# Altium project Fastino-DIOT.PrjPCB (part 1 of 8)
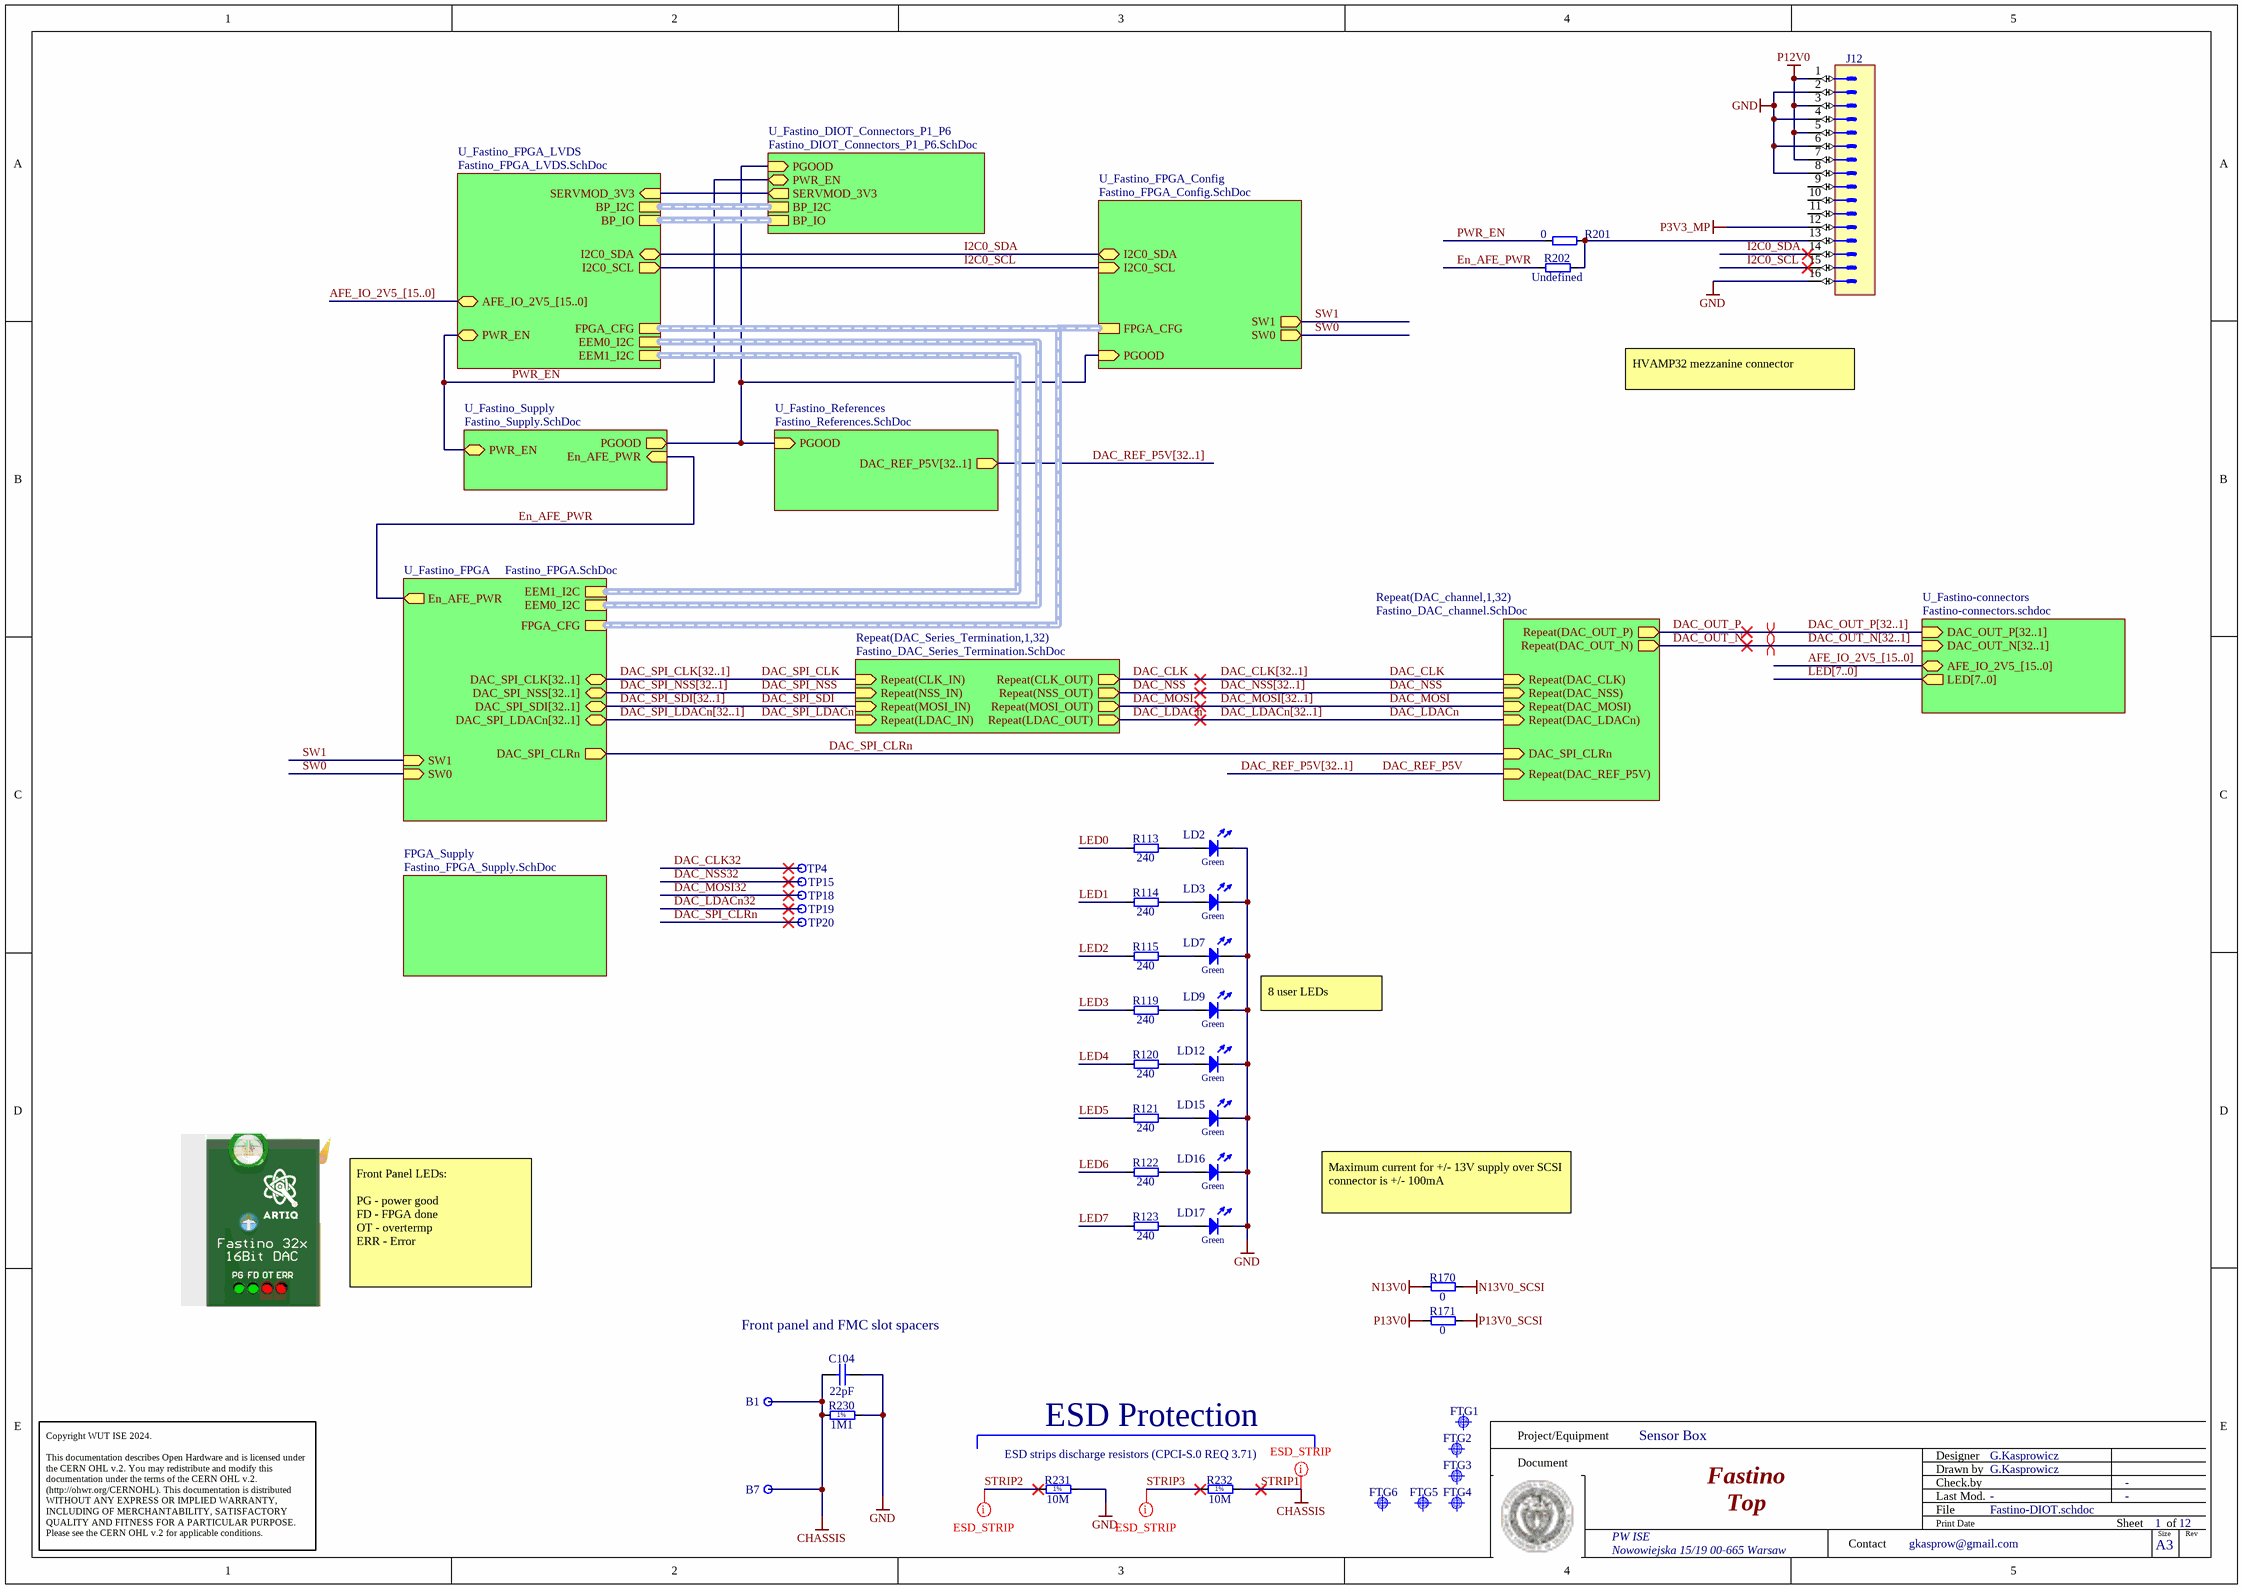
[diagram p0: Fastino-DIOT.schdoc]
rev: 2.0
12 sheets, 1752 parts. Net scope: hierarchical (ports join the sheet entries above them; power ports are global).
Board files: Fastino-DIOT.PCBDOC, Panel_Fastino.PcbDoc
Sheets:
  Fastino-DIOT.schdoc
    DAC_channel1 = Fastino_DAC_channel.SchDoc
    DAC_channel2 = Fastino_DAC_channel.SchDoc
    DAC_channel3 = Fastino_DAC_channel.SchDoc
    DAC_channel4 = Fastino_DAC_channel.SchDoc
    DAC_channel5 = Fastino_DAC_channel.SchDoc
    DAC_channel6 = Fastino_DAC_channel.SchDoc
    DAC_channel7 = Fastino_DAC_channel.SchDoc
    DAC_channel8 = Fastino_DAC_channel.SchDoc
    DAC_channel9 = Fastino_DAC_channel.SchDoc
    DAC_channel10 = Fastino_DAC_channel.SchDoc
    DAC_channel11 = Fastino_DAC_channel.SchDoc
    DAC_channel12 = Fastino_DAC_channel.SchDoc
    DAC_channel13 = Fastino_DAC_channel.SchDoc
    DAC_channel14 = Fastino_DAC_channel.SchDoc
    DAC_channel15 = Fastino_DAC_channel.SchDoc
    DAC_channel16 = Fastino_DAC_channel.SchDoc
    DAC_channel17 = Fastino_DAC_channel.SchDoc
    DAC_channel18 = Fastino_DAC_channel.SchDoc
    DAC_channel19 = Fastino_DAC_channel.SchDoc
    DAC_channel20 = Fastino_DAC_channel.SchDoc
    DAC_channel21 = Fastino_DAC_channel.SchDoc
    DAC_channel22 = Fastino_DAC_channel.SchDoc
    DAC_channel23 = Fastino_DAC_channel.SchDoc
    DAC_channel24 = Fastino_DAC_channel.SchDoc
    DAC_channel25 = Fastino_DAC_channel.SchDoc
    DAC_channel26 = Fastino_DAC_channel.SchDoc
    DAC_channel27 = Fastino_DAC_channel.SchDoc
    DAC_channel28 = Fastino_DAC_channel.SchDoc
    DAC_channel29 = Fastino_DAC_channel.SchDoc
    DAC_channel30 = Fastino_DAC_channel.SchDoc
    DAC_channel31 = Fastino_DAC_channel.SchDoc
    DAC_channel32 = Fastino_DAC_channel.SchDoc
    U_Fastino_FPGA = Fastino_FPGA.SchDoc
    U_Fastino_FPGA_Config = Fastino_FPGA_Config.SchDoc
    U_Fastino_FPGA_LVDS = Fastino_FPGA_LVDS.SchDoc
    FPGA_Supply = Fastino_FPGA_Supply.SchDoc
    U_Fastino_References = Fastino_References.SchDoc
    U_Fastino_Supply = Fastino_Supply.SchDoc
      U_Fastino_Supply_Switching = Fastino_Supply_Switching.SchDoc
    DAC_Series_Termination1 = Fastino_DAC_Series_Termination.SchDoc
    DAC_Series_Termination2 = Fastino_DAC_Series_Termination.SchDoc
    DAC_Series_Termination3 = Fastino_DAC_Series_Termination.SchDoc
    DAC_Series_Termination4 = Fastino_DAC_Series_Termination.SchDoc
    DAC_Series_Termination5 = Fastino_DAC_Series_Termination.SchDoc
    DAC_Series_Termination6 = Fastino_DAC_Series_Termination.SchDoc
    DAC_Series_Termination7 = Fastino_DAC_Series_Termination.SchDoc
    DAC_Series_Termination8 = Fastino_DAC_Series_Termination.SchDoc
    DAC_Series_Termination9 = Fastino_DAC_Series_Termination.SchDoc
    DAC_Series_Termination10 = Fastino_DAC_Series_Termination.SchDoc
    DAC_Series_Termination11 = Fastino_DAC_Series_Termination.SchDoc
    DAC_Series_Termination12 = Fastino_DAC_Series_Termination.SchDoc
    DAC_Series_Termination13 = Fastino_DAC_Series_Termination.SchDoc
    DAC_Series_Termination14 = Fastino_DAC_Series_Termination.SchDoc
    DAC_Series_Termination15 = Fastino_DAC_Series_Termination.SchDoc
    DAC_Series_Termination16 = Fastino_DAC_Series_Termination.SchDoc
    DAC_Series_Termination17 = Fastino_DAC_Series_Termination.SchDoc
    DAC_Series_Termination18 = Fastino_DAC_Series_Termination.SchDoc
    DAC_Series_Termination19 = Fastino_DAC_Series_Termination.SchDoc
    DAC_Series_Termination20 = Fastino_DAC_Series_Termination.SchDoc
    DAC_Series_Termination21 = Fastino_DAC_Series_Termination.SchDoc
    DAC_Series_Termination22 = Fastino_DAC_Series_Termination.SchDoc
    DAC_Series_Termination23 = Fastino_DAC_Series_Termination.SchDoc
    DAC_Series_Termination24 = Fastino_DAC_Series_Termination.SchDoc
    DAC_Series_Termination25 = Fastino_DAC_Series_Termination.SchDoc
    DAC_Series_Termination26 = Fastino_DAC_Series_Termination.SchDoc
    DAC_Series_Termination27 = Fastino_DAC_Series_Termination.SchDoc
    DAC_Series_Termination28 = Fastino_DAC_Series_Termination.SchDoc
    DAC_Series_Termination29 = Fastino_DAC_Series_Termination.SchDoc
    DAC_Series_Termination30 = Fastino_DAC_Series_Termination.SchDoc
    DAC_Series_Termination31 = Fastino_DAC_Series_Termination.SchDoc
    DAC_Series_Termination32 = Fastino_DAC_Series_Termination.SchDoc
    U_Fastino_DIOT_Connectors_P1_P6 = Fastino_DIOT_Connectors_P1_P6.SchDoc
    U_Fastino-connectors = Fastino-connectors.schdoc

## Sheet Fastino-DIOT.schdoc: Fastino
size 420 x 297 mm; EDA_Number: ARTIQ; Projet: Fastino; Author: G.Kasprowicz; CompanyName: WUT ISE; DrawnBy: G.Kasprowicz; Organization: WUT ISE; Address1: PW ISE; Address2: Nowowiejska 15/19 00-665 Warsaw; Address3: gkasprow@gmail.com; DocumentNumber: 1; Revision: 2.0; SheetNumber: 1; SheetTotal: 12; ModifiedBy: -; CheckedDate: -; Title2: Top; DivGrp: WUT ISE; Designer: G.Kasprowicz; ModifiedDate: -; ProjectName: Sensor Box

### Parts
B1  Plated Hole  [MTG270_500]  (value not drawn)  (no BOM)
B7  Plated Hole  [MTG270_500]  (value not drawn)  (no BOM)
C104  22pF  [CAPC1005X55N]
FTG1  Use only in PCB  [FIDUCIAL_TOP_S100-200]  (value not drawn)
FTG2  Use only in PCB  [FIDUCIAL_TOP_S100-200]  (value not drawn)
FTG3  Use only in PCB  [FIDUCIAL_TOP_S100-200]  (value not drawn)
FTG4  Use only in PCB  [FIDUCIAL_TOP_S100-200]  (value not drawn)
FTG5  Use only in PCB  [FIDUCIAL_TOP_S100-200]  (value not drawn)
FTG6  Use only in PCB  [FIDUCIAL_TOP_S100-200]  (value not drawn)
J12  Header 16  [3M_N2516-6002RB]  (value not drawn)
LD2  Green  [LED_AVAGO_HSME-C120]
LD3  Green  [LED_AVAGO_HSME-C120]
LD7  Green  [LED_AVAGO_HSME-C120]
LD9  Green  [LED_AVAGO_HSME-C120]
LD12  Green  [LED_AVAGO_HSME-C120]
LD15  Green  [LED_AVAGO_HSME-C120]
LD16  Green  [LED_AVAGO_HSME-C120]
LD17  Green  [LED_AVAGO_HSME-C120]
R113  240  [RESC1005X40N]
R114  240  [RESC1005X40N]
R115  240  [RESC1005X40N]
R119  240  [RESC1005X40N]
R120  240  [RESC1005X40N]
R121  240  [RESC1005X40N]
R122  240  [RESC1005X40N]
R123  240  [RESC1005X40N]
R170  0  [RESC3216X65N]
R171  0  [RESC3216X65N]
R201  0  [RESC1005X40N]
R202  Undefined  [RESC1608X55N]
R230  1M1  [RESC2012X60N]
R231  10M  [RESC2113X55N]
R232  10M  [RESC2113X55N]
TP4  Test Point  [TPS127]  (value not drawn)  (no BOM)
TP15  Test Point  [TPS127]  (value not drawn)  (no BOM)
TP18  Test Point  [TPS127]  (value not drawn)  (no BOM)
TP19  Test Point  [TPS127]  (value not drawn)  (no BOM)
TP20  Test Point  [TPS127]  (value not drawn)  (no BOM)

### Sub-sheets
FPGA_Supply = Fastino_FPGA_Supply.SchDoc: no entries
Repeat(DAC_channel,1,32) = Fastino_DAC_channel.SchDoc: Repeat(DAC_OUT_P) (out), Repeat(DAC_OUT_N) (out), Repeat(DAC_CLK) (in), Repeat(DAC_NSS) (in), Repeat(DAC_MOSI) (in), DAC_SPI_CLRn (in), Repeat(DAC_LDACn) (in), Repeat(DAC_REF_P5V) (in)
Repeat(DAC_Series_Termination,1,32) = Fastino_DAC_Series_Termination.SchDoc: Repeat(CLK_IN) (in), Repeat(NSS_IN) (in), Repeat(MOSI_IN) (in), Repeat(LDAC_IN) (in), Repeat(CLK_OUT) (out), Repeat(NSS_OUT) (out), Repeat(LDAC_OUT) (out), Repeat(MOSI_OUT) (out)
U_Fastino-connectors = Fastino-connectors.schdoc: DAC_OUT_P[32..1] (in), DAC_OUT_N[32..1] (in), AFE_IO_2V5_[15..0] (bidir), LED[7..0] (out)
U_Fastino_DIOT_Connectors_P1_P6 = Fastino_DIOT_Connectors_P1_P6.SchDoc: PWR_EN (bidir), SERVMOD_3V3 (out), BP_I2C (harness I2C), BP_IO (harness EEM_LVDS), PGOOD (in)
U_Fastino_FPGA = Fastino_FPGA.SchDoc: DAC_SPI_LDACn[32..1] (bidir), DAC_SPI_SDI[32..1] (bidir), DAC_SPI_NSS[32..1] (bidir), DAC_SPI_CLRn (out), DAC_SPI_CLK[32..1] (bidir), FPGA_CFG (harness FPGA_CFG), SW1 (in), SW0 (in), EEM1_I2C (harness I2C), EEM0_I2C (harness I2C), En_AFE_PWR (out)
U_Fastino_FPGA_Config = Fastino_FPGA_Config.SchDoc: PGOOD (in), FPGA_CFG (harness FPGA_CFG), SW1 (out), SW0 (out), I2C0_SCL (in), I2C0_SDA (bidir)
U_Fastino_FPGA_LVDS = Fastino_FPGA_LVDS.SchDoc: EEM0_I2C (harness I2C), EEM1_I2C (harness I2C), PWR_EN (bidir), AFE_IO_2V5_[15..0] (bidir), I2C0_SDA (bidir), I2C0_SCL (out), BP_IO (harness EEM_LVDS), BP_I2C (harness I2C), SERVMOD_3V3 (in), FPGA_CFG (harness FPGA_CFG)
U_Fastino_References = Fastino_References.SchDoc: PGOOD (in), DAC_REF_P5V[32..1] (out)
U_Fastino_Supply = Fastino_Supply.SchDoc: PGOOD (out), PWR_EN (bidir), En_AFE_PWR (in)

### Nets
CHASSIS: B1.1 B7.1 C104.1 R230.1 R232.2  [also labelled STRIP1]
GND: C104.2 J12.2 J12.4 J12.6 J12.8 J12.16 LD2.1(C) LD3.1(C) LD7.1(C) LD9.1(C) LD12.1(C) LD15.1(C) LD16.1(C) LD17.1(C) R230.2 R231.2
N13V0: R170.1
N13V0_SCSI: R170.2
P3V3_MP: J12.12
P12V0: J12.1 J12.3 J12.5 J12.7
P13V0: R171.1
P13V0_SCSI: R171.2
DAC_CLK: sheet Repeat(DAC_channel,1,32)/Repeat(DAC_CLK), sheet Repeat(DAC_Series_Termination,1,32)/Repeat(CLK_OUT)
DAC_CLK32: TP4.1
DAC_LDACn: sheet Repeat(DAC_channel,1,32)/Repeat(DAC_LDACn), sheet Repeat(DAC_Series_Termination,1,32)/Repeat(LDAC_OUT)
DAC_LDACn32: TP19.1
DAC_MOSI: sheet Repeat(DAC_channel,1,32)/Repeat(DAC_MOSI), sheet Repeat(DAC_Series_Termination,1,32)/Repeat(MOSI_OUT)
DAC_MOSI32: TP18.1
DAC_NSS: sheet Repeat(DAC_channel,1,32)/Repeat(DAC_NSS), sheet Repeat(DAC_Series_Termination,1,32)/Repeat(NSS_OUT)
DAC_NSS32: TP15.1
DAC_OUT_N: sheet Repeat(DAC_channel,1,32)/Repeat(DAC_OUT_N)
DAC_OUT_P: sheet Repeat(DAC_channel,1,32)/Repeat(DAC_OUT_P)
DAC_REF_P5V: sheet Repeat(DAC_channel,1,32)/Repeat(DAC_REF_P5V)
DAC_SPI_CLK: sheet Repeat(DAC_Series_Termination,1,32)/Repeat(CLK_IN)
DAC_SPI_CLRn: TP20.1 ; sheet Repeat(DAC_channel,1,32)/DAC_SPI_CLRn, sheet U_Fastino_FPGA/DAC_SPI_CLRn
DAC_SPI_LDACn: sheet Repeat(DAC_Series_Termination,1,32)/Repeat(LDAC_IN)
DAC_SPI_NSS: sheet Repeat(DAC_Series_Termination,1,32)/Repeat(NSS_IN)
DAC_SPI_SDI: sheet Repeat(DAC_Series_Termination,1,32)/Repeat(MOSI_IN)
En_AFE_PWR: R202.1 ; sheet U_Fastino_FPGA/En_AFE_PWR, sheet U_Fastino_Supply/En_AFE_PWR
I2C0_SCL: J12.15 ; sheet U_Fastino_FPGA_Config/I2C0_SCL, sheet U_Fastino_FPGA_LVDS/I2C0_SCL
I2C0_SDA: J12.14 ; sheet U_Fastino_FPGA_Config/I2C0_SDA, sheet U_Fastino_FPGA_LVDS/I2C0_SDA
LED0: R113.1
LED1: R114.1
LED2: R115.1
LED3: R119.1
LED4: R120.1
LED5: R121.1
LED6: R122.1
LED7: R123.1
PGOOD: sheet U_Fastino_FPGA_Config/PGOOD, sheet U_Fastino_References/PGOOD, sheet U_Fastino_Supply/PGOOD, sheet U_Fastino_DIOT_Connectors_P1_P6/PGOOD
PWR_EN: R201.2 ; sheet U_Fastino_FPGA_LVDS/PWR_EN, sheet U_Fastino_Supply/PWR_EN, sheet U_Fastino_DIOT_Connectors_P1_P6/PWR_EN
SERVMOD_3V3: sheet U_Fastino_FPGA_LVDS/SERVMOD_3V3, sheet U_Fastino_DIOT_Connectors_P1_P6/SERVMOD_3V3
STRIP2: R231.1
STRIP3: R232.1
SW0: sheet U_Fastino_FPGA/SW0, sheet U_Fastino_FPGA_Config/SW0
SW1: sheet U_Fastino_FPGA/SW1, sheet U_Fastino_FPGA_Config/SW1
NetJ12_13: J12.13 R201.1 R202.2
NetLD2_2: LD2.2(A) R113.2
NetLD3_2: LD3.2(A) R114.2
NetLD7_2: LD7.2(A) R115.2
NetLD9_2: LD9.2(A) R119.2
NetLD12_2: LD12.2(A) R120.2
NetLD15_2: LD15.2(A) R121.2
NetLD16_2: LD16.2(A) R122.2
NetLD17_2: LD17.2(A) R123.2

Not connected (* = marked no-connect by the designer): J12 9 10 11

### Buses and harness runs
bus AFE_IO_2V5_[15..0] = sheet U_Fastino-connectors/AFE_IO_2V5_[15..0]
bus AFE_IO_2V5_[15..0] = sheet U_Fastino_FPGA_LVDS/AFE_IO_2V5_[15..0]
bus DAC_CLK[32..1]
bus DAC_LDACn[32..1]
bus DAC_MOSI[32..1]
bus DAC_NSS[32..1]
bus DAC_OUT_N[32..1] = sheet U_Fastino-connectors/DAC_OUT_N[32..1]
bus DAC_OUT_P[32..1] = sheet U_Fastino-connectors/DAC_OUT_P[32..1]
bus DAC_REF_P5V[32..1]
bus DAC_REF_P5V[32..1] = sheet U_Fastino_References/DAC_REF_P5V[32..1]
bus DAC_SPI_CLK[32..1] = sheet U_Fastino_FPGA/DAC_SPI_CLK[32..1]
bus DAC_SPI_LDACn[32..1] = sheet U_Fastino_FPGA/DAC_SPI_LDACn[32..1]
bus DAC_SPI_NSS[32..1] = sheet U_Fastino_FPGA/DAC_SPI_NSS[32..1]
bus DAC_SPI_SDI[32..1] = sheet U_Fastino_FPGA/DAC_SPI_SDI[32..1]
bus LED[7..0] = sheet U_Fastino-connectors/LED[7..0]
harness sheet U_Fastino_DIOT_Connectors_P1_P6/BP_I2C = sheet U_Fastino_FPGA_LVDS/BP_I2C
harness sheet U_Fastino_DIOT_Connectors_P1_P6/BP_IO = sheet U_Fastino_FPGA_LVDS/BP_IO
harness sheet U_Fastino_FPGA/EEM0_I2C = sheet U_Fastino_FPGA_LVDS/EEM0_I2C
harness sheet U_Fastino_FPGA/EEM1_I2C = sheet U_Fastino_FPGA_LVDS/EEM1_I2C
harness sheet U_Fastino_FPGA/FPGA_CFG = sheet U_Fastino_FPGA_Config/FPGA_CFG = sheet U_Fastino_FPGA_LVDS/FPGA_CFG

### Layout directives
differential pair: DAC_OUT_N, DAC_OUT_P
net class ESD_STRIP: CHASSIS, STRIP2, STRIP3

### Notes on the sheet
- HVAMP32 mezzanine connector
- 8 user LEDs
- Maximum current for +/- 13V supply over SCSI connector is +/- 100mA
- Front Panel LEDs:
  PG - power good
  FD - FPGA done
  OT - overtermp
  ERR - Error
- (near C104) Front panel and FMC slot spacers
- ESD strips discharge resistors (CPCI-S.0 REQ 3.71)
- ESD Protection
- Project/Equipment
- Document
- Designer
- Drawn by
- Check.by
- Copyright WUT ISE 2024.
  This documentation describes Open Hardware and is licensed under the CERN OHL v.2. You may redistribute and modify this documentation under the terms of the CERN OHL v.2. (http://ohwr.org/CERNOHL). This documentation is distributed WITHOUT ANY EXPRESS OR IMPLIED WARRANTY, INCLUDING OF MERCHANTABILITY, SATISFACTORY QUALITY AND FITNESS FOR A PARTICULAR PURPOSE. Please see the CERN OHL v.2 for applicable conditions.
- Contact
- File
- Last Mod.
- Print Date
- Sheet
- Size
- A3
- of
- Rev
- (in symbol R0805_1M1_1%_0.125W_100PPM) 1%
- (in symbol R0805_10M_1%_0.125W_100PPM_VISHAY_CRCW e3) 1%

### Library data of the parts
B1 B7 = PLATED_HOLE2.7_PAD5.0: Single Terminal Socket; Part Description: Plated Through Hole: Hole Dia.=2.7mm Pad Dia.=5.0mm; Mounted: No; Part Number: PLATED_HOLE2.7_PAD5.0; Component Type: Standard (No BOM); Pin Count: 1; Family: Plated Hole; Socket: No; SMD: No; Sense: No; Status: None; ComponentHeight: 0mm; HelpURL: Undefined; Author: CERN DEM JMW; CreateDate: 27.09.2011; LatestRevisionDate: 27.09.2011; PackageDescription: Plated Through Hole: Hole Dia.=2.7mm Pad Dia.=5.0mm
C104 = CC0402_22PF_50V_5%_C0G: Non-polarised capacitor; Part Description: SMD Multilayer Chip Ceramic Capacitor; Manufacturer: GENERIC; Manufacturer1 Part Number: C0402C220J5GACTU; Voltage: 50V; TC: C0G/NP0; Tolerance: ±5%; Part Number: CC0402_22PF_50V_5%_C0G; Component Kind: Standard; Component Type: Standard; Pin Count: 2; Value: 22pF; Status: Preferred; Manufacturer Part Number: CC0402_22PF_50V_5%_C0G; Case: 0402; Mounted: Yes; Socket: No; SMD: Yes; Manufacturer1 Example: KEMET; Manufacturer1 ComponentHeight: 0.55mm; HelpURL: \\cern.ch\dfs\Applications\Altium\Datasheets\CC0402_C0G_KEMET_(Commercial Grade).pdf; Author: CERN DEM JLC; CreateDate: 2007-12-03; LatestRevisionDate: 2007-12-03; Sense: No
FTG1-FTG6 = FIDUCIAL_TARGET_S100-200: Fiducial Target; Part Description: Square Fiducial Target, Top Layer, 1.0mm, Top Solder 2.0mm, Keepout =2.0mm; Mounted: No; Part Number: FIDUCIAL_TARGET_S100-200; Component Kind: Standard (No BOM); Component Type: Standard (No BOM); Pin Count: 1; Family: Fiducial; Socket: No; SMD: Yes; Sense: No; Status: None; ComponentHeight: 0mm; HelpURL: Undefined; Author: CERN DEM JLC; CreateDate: 09.02.2010; LatestRevisionDate: 04.04.2012; PackageDescription: Square Fiducial Target, Top Layer, 1.0mm, Top Solder 2.0mm, Keepout =2.0mm
J12 = 3M_N2516-6002RB: Connector 16 Male; Part Description: 16 Contacts, Straight .100'' x .100'' Low Profile Four-Wall Header, (Solder Tail 2.84mm), 2500 Series; Manufacturer: 3M; PressFit: No; Part Number: 3M_N2516-6002RB; Component Kind: Standard; Component Type: Standard; Pin Count: 16; Family: Header 16; Mounted: Yes; Socket: No; SMD: No; Sense: No; Status: None; Manufacturer Part Number: N2516-6002RB; ComponentHeight: 10.03mm; HelpURL: \\cern.ch\dfs\Applications\Altium\Datasheets\3M_N2516-6002RB.pdf; Author: CERN DEM JLC; CreateDate: 11.02.2009; LatestRevisionDate: 27.10.2022
LD2 LD3 LD7 LD9 LD12 LD15-LD17 = LED_AVAGO_HSME-C120: LED Green 1C 2A; Part Description: High Performance Right Angle Chip Green LED; Manufacturer: AVAGO TECHNOLOGIES; PressFit: No; Bonding: No; Part Number: LED_AVAGO_HSME-C120; Component Kind: Standard; Component Type: Standard; Color: Green; PackageDescription: Green Chip LED, 2-Leads, Body 1.7x1.1mm, Side Emitting Package; Manufacturer Part Number: HSME-C120; Pin Count: 2; Mounted: Yes; Socket: No; SMD: Yes; Sense: No; ComponentHeight: 0.7mm; HelpURL: \\cern.ch\dfs\Applications\Altium\Datasheets\LED_AVAGO_HSME-C120.pdf; ComponentLink1URL: \\cern.ch\dfs\Applications\Altium\Datasheets\LED_AVAGO_HSME-C110_DESIGN-GUIDE.pdf; ComponentLink1Description: Design Guide; Author: CERN DEM JMW; CreateDate: 22.07.2009; LatestRevisionDate: 20.06.2012
R113-R115 R119-R123 = R0402_240R_1%_0.0625W_100PPM: Resistor - 1%; Part Description: General Purpose Thick Film Chip Resistor; Manufacturer: GENERIC; Manufacturer1 Part Number: 232270672401L; TC: ±100ppm/°C; PressFit: No; Part Number: R0402_240R_1%_0.0625W_100PPM; Component Kind: Standard; Component Type: Standard; Pin Count: 2; Value: 240; Status: Not Recommended; Power: 0.0625W; Tolerance: ±1%; Manufacturer Part Number: R0402_240R_1%_0.0625W_100PPM; Case: 0402; Mounted: Yes; Sense: No; Socket: No; SMD: Yes; Manufacturer1 Example: YAGEO PHYCOMP; Manufacturer1 ComponentHeight: 0.4mm; HelpURL: \\cern.ch\dfs\Applications\Altium\Datasheets\R0402_Phycomp_RC0402.pdf; Author: CERN DEM JLC; CreateDate: 03.12.2007; LatestRevisionDate: 17.10.2012
R170 R171 = R1206_0R_Jumper: Resistor; Part Description: 2A (0.05R Max DC Resistance) Zero Ohm Jumper; Manufacturer: GENERIC; Manufacturer1 Part Number: NRC12Z0; PressFit: No; Part Number: R1206_0R_JUMPER; Component Kind: Standard; Component Type: Standard; Pin Count: 2; Value: 0; Status: Preferred; Manufacturer Part Number: R1206_0R_JUMPER; Case: 1206; Mounted: Yes; Sense: No; Socket: No; SMD: Yes; Manufacturer1 Example: NIC COMPONENT; Manufacturer1 ComponentHeight: 0.65mm; HelpURL: \\cern.ch\dfs\Applications\Altium\Datasheets\R1206_NIC_NRC.pdf; Author: CERN DEM JLC; CreateDate: 03.12.2007; LatestRevisionDate: 13.03.2008
R201 = R0402_0R_JUMPER: Resistor; Part Description: 1A (0.05R Max DC Resistance) Zero Ohm Jumper; Manufacturer: GENERIC; Manufacturer1 Part Number: 232270591001L; PressFit: No; Part Number: R0402_0R_JUMPER; Component Kind: Standard; Component Type: Standard; Pin Count: 2; Value: 0; Status: Not Recommended; Manufacturer Part Number: R0402_0R_JUMPER; Case: 0402; Mounted: Yes; Socket: No; SMD: Yes; Manufacturer1 Example: YAGEO PHYCOMP; Manufacturer1 ComponentHeight: 0.4mm; HelpURL: \\cern.ch\dfs\Applications\Altium\Datasheets\R0402_Phycomp_RC0402.pdf; Author: CERN DEM JLC; CreateDate: 03.12.2007; LatestRevisionDate: 17.10.2012; Sense: No
R202 = R0603_NO-VALUE: Resistor; Part Description: Reserved Footprint For a 0603 (1608) Chip Resistor; PressFit: No; Mounted: No; Part Number: R0603_NO-VALUE; Component Kind: Standard; Component Type: Standard; Pin Count: 2; Value: Undefined; Status: None; Manufacturer: Undefined; Manufacturer Part Number: R0603_NO-VALUE; Case: 0603; Sense: No; Socket: No; SMD: Yes; Manufacturer1 Example: Undefined; Manufacturer1 Part Number: Undefined; Manufacturer1 ComponentHeight: Undefined; HelpURL: Undefined; Author: CERN DEM JLC; CreateDate: 03.12.2007; LatestRevisionDate: 13.03.2008
R230 = R0805_1M1_1%_0.125W_100PPM: Resistor - 1%; Part Description: General Purpose Thick Film Chip Resistor; Manufacturer: GENERIC; Manufacturer1 Part Number: NRC10F1104TRF; Power: 0.125W; TC: ±100ppm/°C; PressFit: No; Part Number: R0805_1M1_1%_0.125W_100PPM; Component Kind: Standard; Component Type: Standard; Pin Count: 2; Value: 1M1; Status: Preferred; Tolerance: ±1%; Manufacturer Part Number: R0805_1M1_1%_0.125W_100PPM; Case: 0805; Mounted: Yes; Sense: No; Socket: No; SMD: Yes; Manufacturer1 Example: NIC COMPONENT; Manufacturer1 ComponentHeight: 0.6mm; HelpURL: \\cern.ch\dfs\Applications\Altium\Datasheets\R0805_NIC_NRC.pdf; Author: CERN DEM JLC; CreateDate: 03/12/2007; LatestRevisionDate: 13/03/2008
R231 R232 = R0805_10M_1%_0.125W_100PPM_VISHAY_CRCW e3: Resistor - 1%; Part Description: 150V, Standard Thick Film Chip Resistor; Manufacturer: VISHAY DALE; Manufacturer Part Number: CRCW080510M0FKEA; Power: 0.125W; TC: ±100ppm/°C; PressFit: No; Part Number: R0805_10M_1%_0.125W_100PPM_VISHAY_CRCW e3; Component Kind: Standard; Component Type: Standard; Pin Count: 2; Value: 10M; Status: None; Tolerance: ±1%; Case: 0805; Mounted: Yes; Sense: No; Socket: No; SMD: Yes; ComponentHeight: 0.5mm; HelpURL: \\cern.ch\dfs\Applications\Altium\Datasheets\R0805_VISHAY_CRCW e3.pdf; Author: CERN DEM BC; CreateDate: 2019-11-12; LatestRevisionDate: 2019-11-12
TP4 TP15 TP18-TP20 = SMD_PAD_1.27X1.27MM: Part Description: 1.27mm x 1.27mm PCB Copper Area (SMD Test Point); Mounted: No; Part Number: SMD_PAD_1.27X1.27MM; Component Type: Standard (No BOM); Pin Count: 1; Family: Test Point; Socket: No; SMD: No; Sense: No; Status: None; ComponentHeight: 0mm; HelpURL: Undefined; Author: CERN DEM JLC; CreateDate: 12.01.2008; LatestRevisionDate: 12.01.2008; PackageDescription: 1.27mm x 1.27mm PCB Copper Area (SMD Test Point)

## Sheet Fastino_DAC_channel.SchDoc: Fastino
size 420 x 297 mm; EDA_Number: ARTIQ; Projet: Fastino; Author: G.Kasprowicz; CompanyName: WUT ISE; DrawnBy: G.Kasprowicz; Organization: WUT ISE; Address1: PW ISE; Address2: Nowowiejska 15/19 00-665 Warsaw; Address3: gkasprow@gmail.com; DocumentNumber: 2; Revision: 2; SheetNumber: 2; SheetTotal: 11; ModifiedBy: -; CheckedDate: -; Title2: DAC channel; DivGrp: WUT ISE; Designer: G.Kasprowicz; ModifiedDate: -; ProjectName: Sensor Box
Used 32 times, as channels DAC_channel1, DAC_channel2, DAC_channel3, DAC_channel4, DAC_channel5, DAC_channel6, DAC_channel7, DAC_channel8, DAC_channel9, DAC_channel10, DAC_channel11, DAC_channel12, DAC_channel13, DAC_channel14, DAC_channel15, DAC_channel16, DAC_channel17, DAC_channel18, DAC_channel19, DAC_channel20, DAC_channel21, DAC_channel22, DAC_channel23, DAC_channel24, DAC_channel25, DAC_channel26, DAC_channel27, DAC_channel28, DAC_channel29, DAC_channel30, DAC_channel31, DAC_channel32. Parts and nets are listed once, with the designators drawn on the sheet.
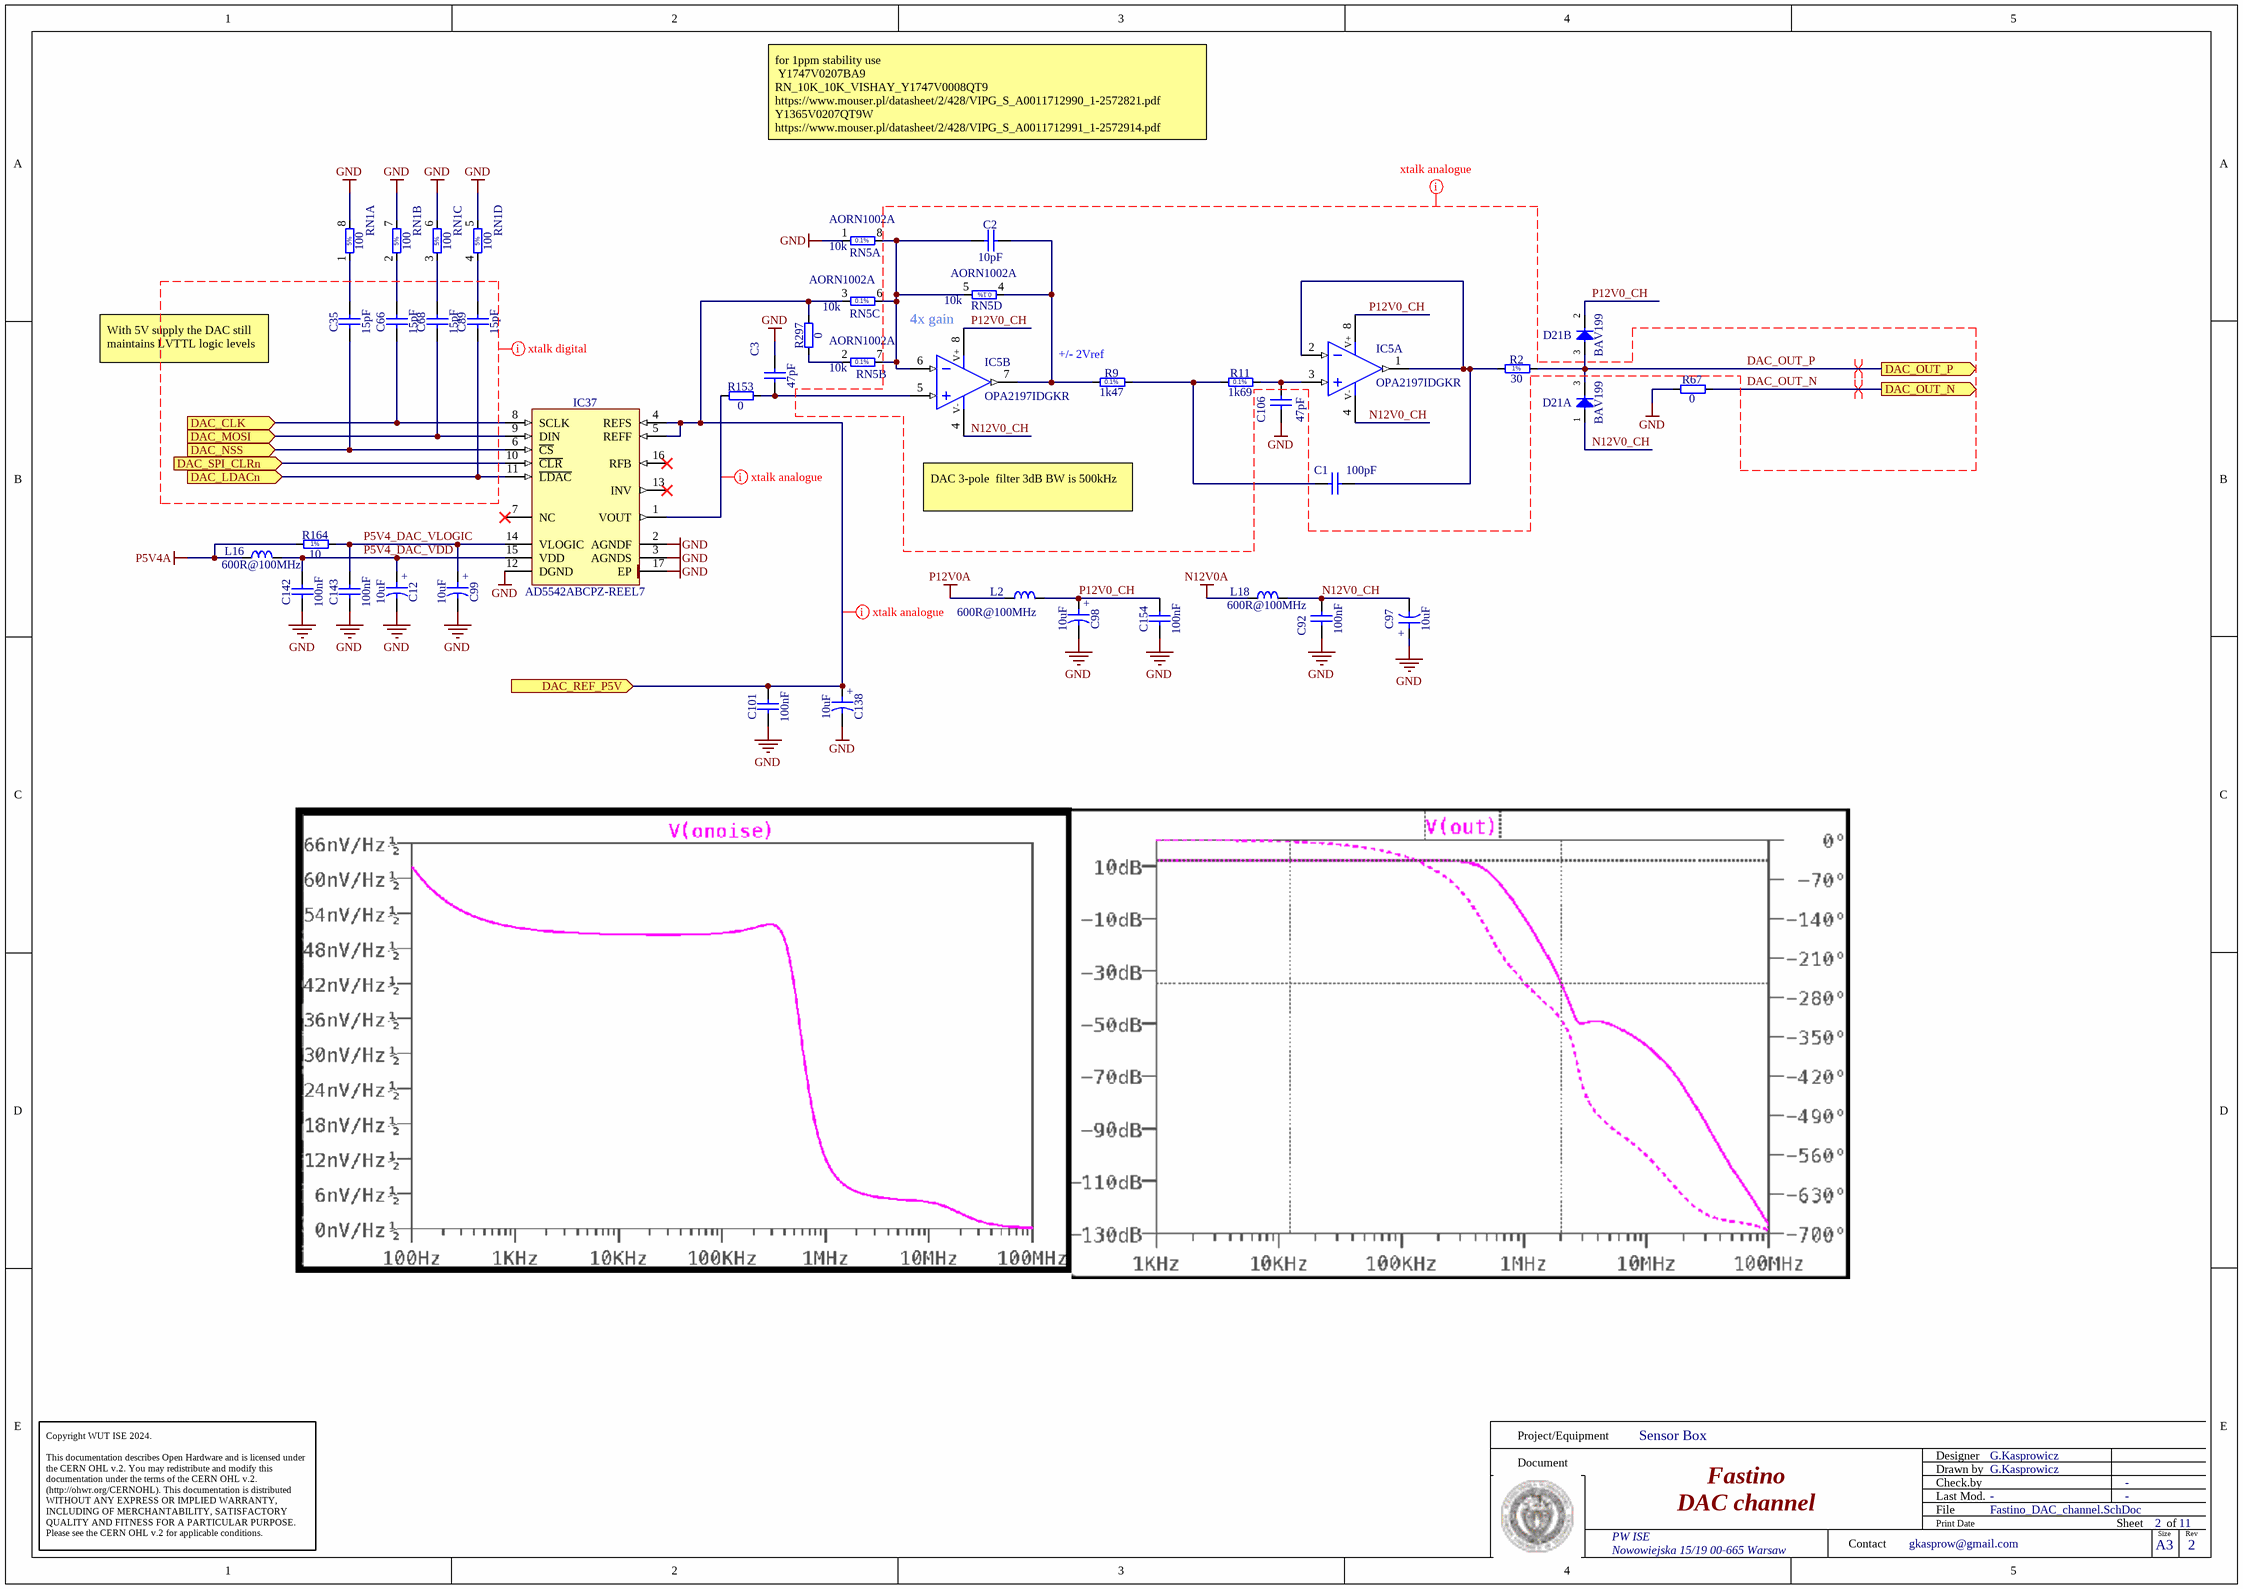
[diagram p1: Fastino_DAC_channel.SchDoc]

### Parts
C1  100pF  [CAPC1608X90N]
C2  10pF  [CAPC1005X55N]
C3  47pF  [CAPC1005X55N]
C12  10uF  [CAPMP3216X180N]
C35  15pF  [CAPC1608X87N]
C66  15pF  [CAPC1608X87N]
C68  15pF  [CAPC1608X87N]
C89  15pF  [CAPC1608X87N]
C92  100nF  [CAPC1005X55N]
C97  10uF  [CAPMP3216X180N]
C98  10uF  [CAPMP3216X180N]
C99  10uF  [CAPMP3216X180N]
C101  100nF  [CAPC1005X55N]
C106  value 47pF  [CAPC1005X55N]
C138  10uF  [CAPMP3216X180N]
C142  100nF  [CAPC1005X55N]
C143  100nF  [CAPC1005X55N]
C154  100nF  [CAPC1005X55N]
D21  BAV199  [SOT95P240X110-3N]  (parts A,B of 2)
IC5  OPA2197IDGKR  [SOP65P490X110-8N]  (parts A,B of 2)
IC37  AD5542ABCPZ-REEL7  [QFN50P300X300X80-17N-S175]
L2  600R@100MHz  [INDC1005X55N]
L16  600R@100MHz  [INDC1005X55N]
L18  600R@100MHz  [INDC1005X55N]
R2  30  [RESC1608X55N]
R9  1k47  [RESC1608X55N]
R11  1k69  [RESC1608X55N]
R67  0  [RESC1608X55N]
R153  0  [RESC1005X40N]
R164  10  [RESC1005X40N]
R297  0  [RESC0603X28N]
RN1  100  [RN_YAGEO_TC124]  (parts A,B,C,D of 4)
RN5  Manufacturer Part Number: AORN1002A  [SOIC127P600X175-8N]  (hidden comment: 10k)  (parts A,B,C,D of 4)

### Ports
DAC_CLK (in), DAC_LDACn (in), DAC_MOSI (in), DAC_NSS (in), DAC_OUT_N (out), DAC_OUT_P (out), DAC_REF_P5V (in), DAC_SPI_CLRn (in)

### Nets
GND: C3.2 C12.2 C92.1 C97.1 C98.2 C99.2 C101.1 C106.1 C138.2 C142.1 C143.1 C154.1 IC37.2(AGNDF) IC37.3(AGNDS) IC37.12(DGND) IC37.17(EP) R67.1 RN1.5 RN1.6 RN1.7 RN1.8 RN5.1
N12V0A: L18.1
P5V4A: L16.1 R164.1
P12V0A: L2.1
DAC_CLK: C66.1 IC37.8(SCLK) ; port DAC_CLK
DAC_LDACn: C89.1 IC37.11(~{LDAC}) ; port DAC_LDACn
DAC_MOSI: C68.1 IC37.9(DIN) ; port DAC_MOSI
DAC_NSS: C35.1 IC37.6(~{CS}) ; port DAC_NSS
DAC_OUT_N: R67.2 ; port DAC_OUT_N
DAC_OUT_P: D21.3(COMAC) R2.2 ; port DAC_OUT_P
DAC_REF_P5V: C101.2 C138.1 IC37.4(REFS) IC37.5(REFF) R297.2 RN5.3 ; port DAC_REF_P5V
DAC_SPI_CLRn: IC37.10(~{CLR}) ; port DAC_SPI_CLRn
N12V0_CH: C92.2 C97.2 D21.1(A) IC5.4(V-) L18.2
P5V4_DAC_VDD: C12.1 C142.2 IC37.15(VDD) L16.2
P5V4_DAC_VLOGIC: C99.1 C143.2 IC37.14(VLOGIC) R164.2
P12V0_CH: C98.1 C154.2 D21.2(C) IC5.8(V+) L2.2
NetC1_1: C1.1 IC5.1(OUT) IC5.2(IN-) R2.1
NetC1_2: C1.2 R9.2 R11.1
NetC2_1: C2.1 IC5.6(IN-) RN5.5 RN5.6 RN5.7 RN5.8
NetC2_2: C2.2 IC5.7(OUT) R9.1 RN5.4
NetC3_1: C3.1 IC5.5(IN+) R153.2
NetC35_2: C35.2 RN1.1
NetC66_2: C66.2 RN1.2
NetC68_2: C68.2 RN1.3
NetC89_2: C89.2 RN1.4
NetC106_2: C106.2 IC5.3(IN+) R11.2
NetIC37_1: IC37.1(VOUT) R153.1
NetR297_1: R297.1 RN5.2

Not connected (* = marked no-connect by the designer): IC37 7(NC)* 13(INV)* 16(RFB)*

### Channels
DAC_channel1: designators end in _1; ports DAC_CLK=DAC_CLK1 DAC_LDACn=DAC_LDACn1 DAC_MOSI=DAC_MOSI1 DAC_NSS=DAC_NSS1 DAC_OUT_N=DAC_OUT_N DAC_OUT_P=DAC_OUT_P DAC_REF_P5V=DAC_REF_P5V1 DAC_SPI_CLRn=DAC_SPI_CLRn
DAC_channel2: designators end in _2; ports DAC_CLK=DAC_CLK2 DAC_LDACn=DAC_LDACn2 DAC_MOSI=DAC_MOSI2 DAC_NSS=DAC_NSS2 DAC_OUT_N=DAC_OUT_N DAC_OUT_P=DAC_OUT_P DAC_REF_P5V=DAC_REF_P5V2 DAC_SPI_CLRn=DAC_SPI_CLRn
DAC_channel3: designators end in _3; ports DAC_CLK=DAC_CLK3 DAC_LDACn=DAC_LDACn3 DAC_MOSI=DAC_MOSI3 DAC_NSS=DAC_NSS3 DAC_OUT_N=DAC_OUT_N DAC_OUT_P=DAC_OUT_P DAC_REF_P5V=DAC_REF_P5V3 DAC_SPI_CLRn=DAC_SPI_CLRn
DAC_channel4: designators end in _4; ports DAC_CLK=DAC_CLK4 DAC_LDACn=DAC_LDACn4 DAC_MOSI=DAC_MOSI4 DAC_NSS=DAC_NSS4 DAC_OUT_N=DAC_OUT_N DAC_OUT_P=DAC_OUT_P DAC_REF_P5V=DAC_REF_P5V4 DAC_SPI_CLRn=DAC_SPI_CLRn
DAC_channel5: designators end in _5; ports DAC_CLK=DAC_CLK5 DAC_LDACn=DAC_LDACn5 DAC_MOSI=DAC_MOSI5 DAC_NSS=DAC_NSS5 DAC_OUT_N=DAC_OUT_N DAC_OUT_P=DAC_OUT_P DAC_REF_P5V=DAC_REF_P5V5 DAC_SPI_CLRn=DAC_SPI_CLRn
DAC_channel6: designators end in _6; ports DAC_CLK=DAC_CLK6 DAC_LDACn=DAC_LDACn6 DAC_MOSI=DAC_MOSI6 DAC_NSS=DAC_NSS6 DAC_OUT_N=DAC_OUT_N DAC_OUT_P=DAC_OUT_P DAC_REF_P5V=DAC_REF_P5V6 DAC_SPI_CLRn=DAC_SPI_CLRn
DAC_channel7: designators end in _7; ports DAC_CLK=DAC_CLK7 DAC_LDACn=DAC_LDACn7 DAC_MOSI=DAC_MOSI7 DAC_NSS=DAC_NSS7 DAC_OUT_N=DAC_OUT_N DAC_OUT_P=DAC_OUT_P DAC_REF_P5V=DAC_REF_P5V7 DAC_SPI_CLRn=DAC_SPI_CLRn
DAC_channel8: designators end in _8; ports DAC_CLK=DAC_CLK8 DAC_LDACn=DAC_LDACn8 DAC_MOSI=DAC_MOSI8 DAC_NSS=DAC_NSS8 DAC_OUT_N=DAC_OUT_N DAC_OUT_P=DAC_OUT_P DAC_REF_P5V=DAC_REF_P5V8 DAC_SPI_CLRn=DAC_SPI_CLRn
DAC_channel9: designators end in _9; ports DAC_CLK=DAC_CLK9 DAC_LDACn=DAC_LDACn9 DAC_MOSI=DAC_MOSI9 DAC_NSS=DAC_NSS9 DAC_OUT_N=DAC_OUT_N DAC_OUT_P=DAC_OUT_P DAC_REF_P5V=DAC_REF_P5V9 DAC_SPI_CLRn=DAC_SPI_CLRn
DAC_channel10: designators end in _10; ports DAC_CLK=DAC_CLK10 DAC_LDACn=DAC_LDACn10 DAC_MOSI=DAC_MOSI10 DAC_NSS=DAC_NSS10 DAC_OUT_N=DAC_OUT_N DAC_OUT_P=DAC_OUT_P DAC_REF_P5V=DAC_REF_P5V10 DAC_SPI_CLRn=DAC_SPI_CLRn
DAC_channel11: designators end in _11; ports DAC_CLK=DAC_CLK11 DAC_LDACn=DAC_LDACn11 DAC_MOSI=DAC_MOSI11 DAC_NSS=DAC_NSS11 DAC_OUT_N=DAC_OUT_N DAC_OUT_P=DAC_OUT_P DAC_REF_P5V=DAC_REF_P5V11 DAC_SPI_CLRn=DAC_SPI_CLRn
DAC_channel12: designators end in _12; ports DAC_CLK=DAC_CLK12 DAC_LDACn=DAC_LDACn12 DAC_MOSI=DAC_MOSI12 DAC_NSS=DAC_NSS12 DAC_OUT_N=DAC_OUT_N DAC_OUT_P=DAC_OUT_P DAC_REF_P5V=DAC_REF_P5V12 DAC_SPI_CLRn=DAC_SPI_CLRn
DAC_channel13: designators end in _13; ports DAC_CLK=DAC_CLK13 DAC_LDACn=DAC_LDACn13 DAC_MOSI=DAC_MOSI13 DAC_NSS=DAC_NSS13 DAC_OUT_N=DAC_OUT_N DAC_OUT_P=DAC_OUT_P DAC_REF_P5V=DAC_REF_P5V13 DAC_SPI_CLRn=DAC_SPI_CLRn
DAC_channel14: designators end in _14; ports DAC_CLK=DAC_CLK14 DAC_LDACn=DAC_LDACn14 DAC_MOSI=DAC_MOSI14 DAC_NSS=DAC_NSS14 DAC_OUT_N=DAC_OUT_N DAC_OUT_P=DAC_OUT_P DAC_REF_P5V=DAC_REF_P5V14 DAC_SPI_CLRn=DAC_SPI_CLRn
DAC_channel15: designators end in _15; ports DAC_CLK=DAC_CLK15 DAC_LDACn=DAC_LDACn15 DAC_MOSI=DAC_MOSI15 DAC_NSS=DAC_NSS15 DAC_OUT_N=DAC_OUT_N DAC_OUT_P=DAC_OUT_P DAC_REF_P5V=DAC_REF_P5V15 DAC_SPI_CLRn=DAC_SPI_CLRn
DAC_channel16: designators end in _16; ports DAC_CLK=DAC_CLK16 DAC_LDACn=DAC_LDACn16 DAC_MOSI=DAC_MOSI16 DAC_NSS=DAC_NSS16 DAC_OUT_N=DAC_OUT_N DAC_OUT_P=DAC_OUT_P DAC_REF_P5V=DAC_REF_P5V16 DAC_SPI_CLRn=DAC_SPI_CLRn
DAC_channel17: designators end in _17; ports DAC_CLK=DAC_CLK17 DAC_LDACn=DAC_LDACn17 DAC_MOSI=DAC_MOSI17 DAC_NSS=DAC_NSS17 DAC_OUT_N=DAC_OUT_N DAC_OUT_P=DAC_OUT_P DAC_REF_P5V=DAC_REF_P5V17 DAC_SPI_CLRn=DAC_SPI_CLRn
DAC_channel18: designators end in _18; ports DAC_CLK=DAC_CLK18 DAC_LDACn=DAC_LDACn18 DAC_MOSI=DAC_MOSI18 DAC_NSS=DAC_NSS18 DAC_OUT_N=DAC_OUT_N DAC_OUT_P=DAC_OUT_P DAC_REF_P5V=DAC_REF_P5V18 DAC_SPI_CLRn=DAC_SPI_CLRn
DAC_channel19: designators end in _19; ports DAC_CLK=DAC_CLK19 DAC_LDACn=DAC_LDACn19 DAC_MOSI=DAC_MOSI19 DAC_NSS=DAC_NSS19 DAC_OUT_N=DAC_OUT_N DAC_OUT_P=DAC_OUT_P DAC_REF_P5V=DAC_REF_P5V19 DAC_SPI_CLRn=DAC_SPI_CLRn
DAC_channel20: designators end in _20; ports DAC_CLK=DAC_CLK20 DAC_LDACn=DAC_LDACn20 DAC_MOSI=DAC_MOSI20 DAC_NSS=DAC_NSS20 DAC_OUT_N=DAC_OUT_N DAC_OUT_P=DAC_OUT_P DAC_REF_P5V=DAC_REF_P5V20 DAC_SPI_CLRn=DAC_SPI_CLRn
DAC_channel21: designators end in _21; ports DAC_CLK=DAC_CLK21 DAC_LDACn=DAC_LDACn21 DAC_MOSI=DAC_MOSI21 DAC_NSS=DAC_NSS21 DAC_OUT_N=DAC_OUT_N DAC_OUT_P=DAC_OUT_P DAC_REF_P5V=DAC_REF_P5V21 DAC_SPI_CLRn=DAC_SPI_CLRn
DAC_channel22: designators end in _22; ports DAC_CLK=DAC_CLK22 DAC_LDACn=DAC_LDACn22 DAC_MOSI=DAC_MOSI22 DAC_NSS=DAC_NSS22 DAC_OUT_N=DAC_OUT_N DAC_OUT_P=DAC_OUT_P DAC_REF_P5V=DAC_REF_P5V22 DAC_SPI_CLRn=DAC_SPI_CLRn
DAC_channel23: designators end in _23; ports DAC_CLK=DAC_CLK23 DAC_LDACn=DAC_LDACn23 DAC_MOSI=DAC_MOSI23 DAC_NSS=DAC_NSS23 DAC_OUT_N=DAC_OUT_N DAC_OUT_P=DAC_OUT_P DAC_REF_P5V=DAC_REF_P5V23 DAC_SPI_CLRn=DAC_SPI_CLRn
DAC_channel24: designators end in _24; ports DAC_CLK=DAC_CLK24 DAC_LDACn=DAC_LDACn24 DAC_MOSI=DAC_MOSI24 DAC_NSS=DAC_NSS24 DAC_OUT_N=DAC_OUT_N DAC_OUT_P=DAC_OUT_P DAC_REF_P5V=DAC_REF_P5V24 DAC_SPI_CLRn=DAC_SPI_CLRn
DAC_channel25: designators end in _25; ports DAC_CLK=DAC_CLK25 DAC_LDACn=DAC_LDACn25 DAC_MOSI=DAC_MOSI25 DAC_NSS=DAC_NSS25 DAC_OUT_N=DAC_OUT_N DAC_OUT_P=DAC_OUT_P DAC_REF_P5V=DAC_REF_P5V25 DAC_SPI_CLRn=DAC_SPI_CLRn
DAC_channel26: designators end in _26; ports DAC_CLK=DAC_CLK26 DAC_LDACn=DAC_LDACn26 DAC_MOSI=DAC_MOSI26 DAC_NSS=DAC_NSS26 DAC_OUT_N=DAC_OUT_N DAC_OUT_P=DAC_OUT_P DAC_REF_P5V=DAC_REF_P5V26 DAC_SPI_CLRn=DAC_SPI_CLRn
DAC_channel27: designators end in _27; ports DAC_CLK=DAC_CLK27 DAC_LDACn=DAC_LDACn27 DAC_MOSI=DAC_MOSI27 DAC_NSS=DAC_NSS27 DAC_OUT_N=DAC_OUT_N DAC_OUT_P=DAC_OUT_P DAC_REF_P5V=DAC_REF_P5V27 DAC_SPI_CLRn=DAC_SPI_CLRn
DAC_channel28: designators end in _28; ports DAC_CLK=DAC_CLK28 DAC_LDACn=DAC_LDACn28 DAC_MOSI=DAC_MOSI28 DAC_NSS=DAC_NSS28 DAC_OUT_N=DAC_OUT_N DAC_OUT_P=DAC_OUT_P DAC_REF_P5V=DAC_REF_P5V28 DAC_SPI_CLRn=DAC_SPI_CLRn
DAC_channel29: designators end in _29; ports DAC_CLK=DAC_CLK29 DAC_LDACn=DAC_LDACn29 DAC_MOSI=DAC_MOSI29 DAC_NSS=DAC_NSS29 DAC_OUT_N=DAC_OUT_N DAC_OUT_P=DAC_OUT_P DAC_REF_P5V=DAC_REF_P5V29 DAC_SPI_CLRn=DAC_SPI_CLRn
DAC_channel30: designators end in _30; ports DAC_CLK=DAC_CLK30 DAC_LDACn=DAC_LDACn30 DAC_MOSI=DAC_MOSI30 DAC_NSS=DAC_NSS30 DAC_OUT_N=DAC_OUT_N DAC_OUT_P=DAC_OUT_P DAC_REF_P5V=DAC_REF_P5V30 DAC_SPI_CLRn=DAC_SPI_CLRn
DAC_channel31: designators end in _31; ports DAC_CLK=DAC_CLK31 DAC_LDACn=DAC_LDACn31 DAC_MOSI=DAC_MOSI31 DAC_NSS=DAC_NSS31 DAC_OUT_N=DAC_OUT_N DAC_OUT_P=DAC_OUT_P DAC_REF_P5V=DAC_REF_P5V31 DAC_SPI_CLRn=DAC_SPI_CLRn
DAC_channel32: designators end in _32; ports DAC_CLK=DAC_CLK32 DAC_LDACn=DAC_LDACn32 DAC_MOSI=DAC_MOSI32 DAC_NSS=DAC_NSS32 DAC_OUT_N=DAC_OUT_N DAC_OUT_P=DAC_OUT_P DAC_REF_P5V=DAC_REF_P5V32 DAC_SPI_CLRn=DAC_SPI_CLRn

### Layout directives
differential pair: DAC_OUT_N, DAC_OUT_P
net class xtalk analogue: DAC_OUT_N, DAC_OUT_P, DAC_REF_P5V1, N12V0_CH, NetIC37_1_1, P12V0_CH
net class xtalk digital: (no net found under the mark)

### Notes on the sheet
- for 1ppm stability use
  Y1747V0207BA9
  RN_10K_10K_VISHAY_Y1747V0008QT9
  https://www.mouser.pl/datasheet/2/428/VIPG_S_A0011712990_1-2572821.pdf
  Y1365V0207QT9W
  https://www.mouser.pl/datasheet/2/428/VIPG_S_A0011712991_1-2572914.pdf
- 4x gain
- With 5V supply the DAC still maintains LVTTL logic levels
- (near R9) +/- 2Vref
- DAC 3-pole  filter 3dB BW is 500kHz
- Project/Equipment
- Document
- Designer
- Drawn by
- Check.by
- Copyright WUT ISE 2024.
  This documentation describes Open Hardware and is licensed under the CERN OHL v.2. You may redistribute and modify this documentation under the terms of the CERN OHL v.2. (http://ohwr.org/CERNOHL). This documentation is distributed WITHOUT ANY EXPRESS OR IMPLIED WARRANTY, INCLUDING OF MERCHANTABILITY, SATISFACTORY QUALITY AND FITNESS FOR A PARTICULAR PURPOSE. Please see the CERN OHL v.2 for applicable conditions.
- Contact
- File
- Last Mod.
- Print Date
- Sheet
- Size
- A3
- of
- Rev
- (in symbol CTE3216-18_10UF_16V_20%_AVX_TCJ) +
- (in symbol R0402_10R_1%_0.0625W_200PPM) 1%
- (in symbol R0603_1K47_0.1%_0.063W_10PPM) 0.1%
- (in symbol R0603_1K69_0.1%_0.063W_10PPM) 0.1%
- (in symbol R0603_30R_1%_0.1W_100PPM) 1%
- (in symbol RES_RN_100R_YAGEO_TC124-JR-07100RL, part A) 5%
- (in symbol RES_RN_100R_YAGEO_TC124-JR-07100RL, part B) 5%
- (in symbol RES_RN_100R_YAGEO_TC124-JR-07100RL, part C) 5%
- (in symbol RES_RN_100R_YAGEO_TC124-JR-07100RL, part D) 5%
- (in symbol RN_10K_VISHAY_AORN1002A, part A) 0.1%
- (in symbol RN_10K_VISHAY_AORN1002A, part B) 0.1%
- (in symbol RN_10K_VISHAY_AORN1002A, part C) 0.1%
- (in symbol RN_10K_VISHAY_AORN1002A, part D) 0.1%

### Library data of the parts
C1 = CC0603_100PF_50V_1%_NP0: Non-polarised capacitor; Part Description: SMD Multilayer Chip Ceramic Capacitor; Manufacturer: GENERIC; Manufacturer1 Part Number: 06035A101FAT2A; Voltage: 50V; TC: C0G/NP0; Tolerance: ±1%; Part Number: CC0603_100PF_50V_1%_NP0; Component Kind: Standard; Component Type: Standard; Pin Count: 2; Value: 100pF; Status: None; Manufacturer Part Number: CC0603_100PF_50V_1%_NP0; Case: 0603; Mounted: Yes; Socket: No; SMD: Yes; Sense: No; Manufacturer1 Example: AVX; Manufacturer1 ComponentHeight: 0.9mm; HelpURL: \\cern.ch\dfs\Applications\Altium\Datasheets\CC0603_C0G_AVX.pdf; Author: CERN DEM JLC; CreateDate: 15.06.2017; LatestRevisionDate: 15.06.2017
C2 = CC0402_10PF_50V_5%_C0G: Non-polarised capacitor; Part Description: SMD Multilayer Chip Ceramic Capacitor; Manufacturer: GENERIC; Manufacturer1 Part Number: C0402C100J5GACTU; Voltage: 50V; TC: C0G/NP0; Tolerance: ±5%; Part Number: CC0402_10PF_50V_5%_C0G; Component Kind: Standard; Component Type: Standard; Pin Count: 2; Value: 10pF; Status: Preferred; Manufacturer Part Number: CC0402_10PF_50V_5%_C0G; Case: 0402; Mounted: Yes; Socket: No; SMD: Yes; Sense: No; Manufacturer1 Example: KEMET; Manufacturer1 ComponentHeight: 0.55mm; HelpURL: \\cern.ch\dfs\Applications\Altium\Datasheets\CC0805_C0G_KEMET_(Commercial Grade).pdf; Author: CERN DEM JLC; CreateDate: 03.12.2007; LatestRevisionDate: 22.04.2015
C3 C106 = CC0402_47PF_50V_1%_C0G_MURATA_GJM1555C1H470FB01D: Non-polarised capacitor; Part Description: High-Q SMD Chip Monolithic Ceramic Capacitor; Manufacturer: MURATA; Voltage: 50V; TC: C0G/NP0; Tolerance: ±1%; Part Number: CC0402_47PF_50V_1%_C0G_MURATA_GJM1555C1H470FB01D; Component Kind: Standard; Component Type: Standard; Pin Count: 2; Status: None; Case: 0402; Mounted: Yes; Socket: No; SMD: Yes; Sense: No; ComponentHeight: 0.55mm; HelpURL: \\cern.ch\dfs\Applications\Altium\Datasheets\CC0402_MURATA_GJM1555C1H470FB01D.pdf; Author: CERN DEM BC; CreateDate: 20.11.2017; LatestRevisionDate: 20.11.2017
  C3: Value: 47pF; Manufacturer Part Number: GJM1555C1H470FB01D
  C106: Manufacturer Part Number: GJM1555C1H470FB01
C12 C97-C99 C138 = CTE3216-18_10UF_16V_20%_AVX_TCJ: Polarised capacitor; Part Description: ESR 0R200 Tantalum Solid Electrolytic Chip Capacitor with Conductive Polymer Electrode; Manufacturer: AVX; Manufacturer Part Number: TCJA106M016R0200 or  or TR3A106K016C1700; Voltage: 16V; Tolerance: ±20%; Part Number: CTE3216-18_10UF_16V_20%_AVX_TCJ; Component Kind: Standard; Component Type: Standard; Pin Count: 2; Value: 10uF; Status: Preferred; Case: A; Mounted: Yes; Socket: No; SMD: Yes; Sense: No; ComponentHeight: 1.8mm; HelpURL: \\cern.ch\dfs\Applications\Altium\Datasheets\CTE_AVX_TCJ.pdf; Author: CERN DEM JLC; CreateDate: 29.03.2012; LatestRevisionDate: 29.03.2012
C35 C66 C68 C89 = CC0603_15PF_50V_5%_NP0: Non-polarised capacitor; Part Description: SMD Multilayer Chip Ceramic Capacitor; Manufacturer: GENERIC; Manufacturer1 Part Number: 223886715159; Voltage: 50V; TC: C0G/NP0; Tolerance: ±5%; Part Number: CC0603_15PF_50V_5%_NP0; Component Kind: Standard; Component Type: Standard; Pin Count: 2; Value: 15pF; Status: Preferred; Manufacturer Part Number: CC0603_15PF_50V_5%_NP0; Case: 0603; Mounted: Yes; Socket: No; SMD: Yes; Sense: No; Manufacturer1 Example: PHYCOMP; Manufacturer1 ComponentHeight: 0.87mm; HelpURL: \\cern.ch\dfs\Applications\Altium\Datasheets\CC0603_NP0_PHYCOMP.pdf; Author: CERN DEM JLC; CreateDate: 03/12/2007; LatestRevisionDate: 03/12/2007
C92 C101 C142 C143 C154 = CC0402_100NF_16V_10%_X7R: Non-polarised capacitor; Part Description: SMD Multilayer Chip Ceramic Capacitor; Manufacturer: GENERIC; Manufacturer1 Part Number: GRM155R71C104KA88D; Voltage: 16V; TC: X7R; Tolerance: ±10%; Part Number: CC0402_100NF_16V_10%_X7R; Component Kind: Standard; Component Type: Standard; Pin Count: 2; Value: 100nF; Status: Not Recommended; Manufacturer Part Number: CC0402_100NF_16V_10%_X7R; Case: 0402; Mounted: Yes; Socket: No; SMD: Yes; Sense: No; Manufacturer1 Example: MURATA; Manufacturer1 ComponentHeight: 0.55mm; HelpURL: \\cern.ch\dfs\Applications\Altium\Datasheets\CC0402_X7R_MURATA_GRM.pdf; Author: CERN DEM JLC; CreateDate: 2013-12-05; LatestRevisionDate: 2007-12-03
D21 = BAV199: Serial Diode; Part Description: Low-Leakage Double Diode; Manufacturer: NXP SEMICONDUCTORS; Voltage: 75V; Power: 250mW; PressFit: No; Bonding: No; Part Number: BAV199; Component Kind: Standard; Component Type: Standard; Device: BAV199; PackageDescription: SOT23 3-Leads, Pitch 0.95mm - Body 1.4x3mm, IPC Medium Density; Manufacturer Part Number: BAV199; Pin Count: 3; Case: SOT23-3; Mounted: Yes; Socket: No; SMD: Yes; Sense: No; ComponentHeight: 1.1mm; HelpURL: \\cern.ch\dfs\Applications\Altium\Datasheets\BAV199.pdf; Author: CERN DEM JMW; CreateDate: 2008-11-21; LatestRevisionDate: 2008-11-21
IC5 = OA_OPA2197IDGKR: 36-V, Precision, Rail-to-Rail Input Output, Low Offset Voltage Op Amp 8-VSSOP; Part Description: High-Precision, Low-Noise, Rail-to-Rail Output,10-MHz Op Amp; Manufacturer: TEXAS INSTRUMENTS; PressFit: No; Bonding: No; Part Number: OPA2197IDGKR; Component Kind: Standard; Component Type: Standard; Device: OPA2197IDGKR; PackageDescription: SOP, 0.65mm pitch; 8 pin, 3.00mm W X 3.00mm L X 1.10mm H body, IPC Medium Density; Manufacturer Part Number: OPA2197IDGKR; Pin Count: 8; Case: MSOP8; Mounted: Yes; Socket: No; SMD: Yes; Sense: No; ComponentHeight: 1.1mm; Author: GK; HelpURL: \\cern.ch\dfs\Applications\Altium\Datasheets\OPA2140AIDGK.pdf; CreateDate: 20.04.2017; LatestRevisionDate: 20.04.2017
IC37 = AD5542ABCPZ-REEL7: 2.7V to 5.5V, Serial-Input, Voltage-Output, 16-Bit DAC; Manufacturer: ANALOG DEVICES; PressFit: No; Bonding: No; Part Number: AD5542ABCPZ-REEL7; Component Kind: Standard; Component Type: Standard; Device: AD5542ABCPZ-REEL7; PackageDescription: QFN, 0.50mm Pitch, Square; 16 Pin, 3.00mm L X 3.00mm W X 0.80mm H Body (w/Thermal Tab 1.75 X 1.75mm),  IPC Medium Density; Part Description: 2.7V to 5.5V, Serial-Input, Voltage-Output, 16-Bit DAC; Manufacturer Part Number: AD5542ABCPZ-REEL7; Pin Count: 17; Case: QFN16; Mounted: Yes; Socket: No; SMD: Yes; Sense: No; ComponentHeight: 0.8mm; Author: CERN DEM JLC; HelpURL: \\cern.ch\dfs\Applications\Altium\Datasheets\AD5542ABCPZ-REEL7.pdf; CreateDate: 29.11.2018; LatestRevisionDate: 29.11.2018
L2 L16 L18 = IND0402_MURATA_BLM15HD601SN1: Inductor; Part Description: SMD EMIFIL Suppression Chip Ferrite Bead; Manufacturer: MURATA; Manufacturer Part Number: BLM15HD601SN1D; Power: 300mA; Resistance: 0.85R; Tolerance: ±25%; Part Number: IND0402_MURATA_BLM15HD601SN1; Component Kind: Standard; Component Type: Standard; Pin Count: 2; Value: 600R@100MHz; Status: None; Case: 0402; Mounted: Yes; Socket: No; SMD: Yes; Sense: No; ComponentHeight: 0.55mm; HelpURL: \\cern.ch\dfs\Applications\Altium\Datasheets\IND0402_MURATA_BLM15H.pdf; Author: CERN DEM JLC; CreateDate: 28/02/2012; LatestRevisionDate: 28/02/2012
R2 = R0603_30R_1%_0.1W_100PPM: Resistor - 1%; Part Description: General Purpose Thick Film Chip Resistor; Manufacturer: GENERIC; Manufacturer1 Part Number: NRC06F30R0TRF; Power: 0.1W; TC: ±100ppm/°C; PressFit: No; Part Number: R0603_30R_1%_0.1W_100PPM; Component Kind: Standard; Component Type: Standard; Pin Count: 2; Value: 30; Status: Preferred; Tolerance: ±1%; Manufacturer Part Number: R0603_30R_1%_0.1W_100PPM; Case: 0603; Mounted: Yes; Sense: No; Socket: No; SMD: Yes; Manufacturer1 Example: NIC COMPONENT; Manufacturer1 ComponentHeight: 0.55mm; HelpURL: \\cern.ch\dfs\Applications\Altium\Datasheets\R0603_NIC_NRC.pdf; Author: CERN DEM JLC; CreateDate: 03/12/2007; LatestRevisionDate: 13/03/2008
R9 = R0603_1K47_0.1%_0.063W_10PPM: Resistor - 0.1%; Part Description: Thin Film Chip Resistor; Manufacturer: GENERIC; Manufacturer1 Part Number: RN73C1J1K47BTDF; Power: 0.063W; TC: ±10ppm; PressFit: No; Part Number: R0603_1K47_0.1%_0.063W_10PPM; Component Kind: Standard; Component Type: Standard; Pin Count: 2; Value: 1k47; Status: Not Recommended; Tolerance: ±0.1%; Manufacturer Part Number: R0603_1K47_0.1%_0.063W_10PPM; Case: 0603; Mounted: Yes; Sense: No; Socket: No; SMD: Yes; Manufacturer1 Example: TYCO HOLSWORTHY; Manufacturer1 ComponentHeight: 0.5mm; HelpURL: \\cern.ch\dfs\Applications\Altium\Datasheets\R0603_Tyco_RN73.pdf; Author: CERN DEM JLC; CreateDate: 03.12.2007; LatestRevisionDate: 13.03.2008
R11 = R0603_1K69_0.1%_0.063W_10PPM: Resistor - 0.1%; Part Description: Thin Film Chip Resistor; Manufacturer: GENERIC; Manufacturer1 Part Number: RN73C1J1K69BTDF; Power: 0.063W; TC: ±10ppm; PressFit: No; Part Number: R0603_1K69_0.1%_0.063W_10PPM; Component Kind: Standard; Component Type: Standard; Pin Count: 2; Value: 1k69; Status: Not Recommended; Tolerance: ±0.1%; Manufacturer Part Number: R0603_1K69_0.1%_0.063W_10PPM; Case: 0603; Mounted: Yes; Sense: No; Socket: No; SMD: Yes; Manufacturer1 Example: TYCO HOLSWORTHY; Manufacturer1 ComponentHeight: 0.5mm; HelpURL: \\cern.ch\dfs\Applications\Altium\Datasheets\R0603_Tyco_RN73.pdf; Author: CERN DEM JLC; CreateDate: 03.12.2007; LatestRevisionDate: 13.03.2008
R67 = R0603_0R_JUMPER: Resistor; Part Description: 1A (0.05R Max DC Resistance) Zero Ohm Jumper; Manufacturer: GENERIC; Manufacturer1 Part Number: NRC06Z0; PressFit: No; Part Number: R0603_0R_JUMPER; Component Kind: Standard; Component Type: Standard; Pin Count: 2; Value: 0; Status: Preferred; Manufacturer Part Number: R0603_0R_JUMPER; Case: 0603; Mounted: Yes; Sense: No; Socket: No; SMD: Yes; Manufacturer1 Example: NIC COMPONENT; Manufacturer1 ComponentHeight: 0.55mm; HelpURL: \\cern.ch\dfs\Applications\Altium\Datasheets\R0603_NIC_NRC.pdf; Author: CERN DEM JLC; CreateDate: 03.12.2007; LatestRevisionDate: 13.03.2008
R153 = R0402_0R_JUMPER: as R201 on sheet Fastino-DIOT; Part Number: R0402_0R_JUMPER; Component Kind: Standard; Component Type: Standard; Pin Count: 2; Value: 0; Status: Not Recommended; Manufacturer Part Number: R0402_0R_JUMPER; Case: 0402; Mounted: Yes; Sense: No; Socket: No; SMD: Yes; Manufacturer1 Example: YAGEO PHYCOMP; Manufacturer1 ComponentHeight: 0.4mm; HelpURL: \\cern.ch\dfs\Applications\Altium\Datasheets\R0402_Phycomp_RC0402.pdf; Author: CERN DEM JLC; CreateDate: 03.12.2007; LatestRevisionDate: 17.10.2012
R164 = R0402_10R_1%_0.0625W_200PPM: Resistor - 1%; Part Description: General Purpose Thick Film Chip Resistor; Manufacturer: GENERIC; Manufacturer1 Part Number: 232270671009L; TC: ±200ppm/°C; PressFit: No; Part Number: R0402_10R_1%_0.0625W_200PPM; Component Kind: Standard; Component Type: Standard; Pin Count: 2; Value: 10; Status: Not Recommended; Power: 0.0625W; Tolerance: ±1%; Manufacturer Part Number: R0402_10R_1%_0.0625W_200PPM; Case: 0402; Mounted: Yes; Sense: No; Socket: No; SMD: Yes; Manufacturer1 Example: YAGEO PHYCOMP; Manufacturer1 ComponentHeight: 0.4mm; HelpURL: \\cern.ch\dfs\Applications\Altium\Datasheets\R0402_Phycomp_RC0402.pdf; Author: CERN DEM JLC; CreateDate: 24.06.2009; LatestRevisionDate: 17.10.2012
R297 = R0201_0R_JUMPER: Resistor; Part Description: 1A (0.05R Max DC Resistance) Zero Ohm Jumper; Manufacturer: GENERIC; Manufacturer1 Part Number: CRCW02010000Z0ED; PressFit: No; Part Number: R0201_0R_JUMPER; Component Kind: Standard; Component Type: Standard; Pin Count: 2; Value: 0; Status: Not Recommended; Manufacturer Part Number: R0201_0R_JUMPER; Case: 0201; Mounted: Yes; Sense: No; Socket: No; SMD: Yes; Manufacturer1 Example: VISHAY; Manufacturer1 ComponentHeight: 0.27mm; HelpURL: \\cern.ch\dfs\Applications\Altium\Datasheets\R0201_VISHAY_CRCW e3.pdf; Author: CERN DEM JLC; CreateDate: 19.11.2014; LatestRevisionDate: 08.01.2015
RN1 = RES_RN_100R_YAGEO_TC124-JR-07100RL: DIL8 Resistor Network 4 Isolated Resistor 5%; Part Description: Chip Resistor Array , 4 Isolated Resistors (Side Concave Terminal), TC124 Series; Manufacturer: YAGEO; Power: 0.062W; TC: ±200ppm/°C; PressFit: No; Part Number: RN_100R_YAGEO_TC124-JR-07100RL; Component Kind: Standard; Component Type: Standard; Pin Count: 8; Value: 100; Sense: No; Status: Not recommended; Tolerance: ±5%; Manufacturer Part Number: TC124-JR-07100RL; Case: 0408; Mounted: Yes; Socket: No; SMD: Yes; ComponentHeight: 0.5mm; HelpURL: \\cern.ch\dfs\Applications\Altium\Datasheets\RN_YAGEO_TC124.pdf; Author: CERN DEM BC; CreateDate: 06.05.2019; LatestRevisionDate: 06.05.2019
RN5 = RN_10K_VISHAY_AORN1002A: DIL8 Resistor Network 4 Isolated Resistor 0.1%; Part Description: Dual-In-Line Thin Film Precision Automotive Resistors Network, (4 Isolated) - AORN Series; Manufacturer: VISHAY DALE; Power: 4x0.1W; TC: ±25ppm/°C; PressFit: No; Part Number: RN_10K_VISHAY_AORN1002A; Component Kind: Standard; Component Type: Standard; Pin Count: 8; Value: 10k; Sense: No; Tolerance: ±0.1%; Case: SOIC8; Mounted: Yes; Socket: No; SMD: Yes; ComponentHeight: 1.73mm; HelpURL: \\cern.ch\dfs\Applications\Altium\Datasheets\RN_VISHAY_AORN.pdf; Author: CERN DEM JLC; CreateDate: 20.02.2017; LatestRevisionDate: 03.05.2017